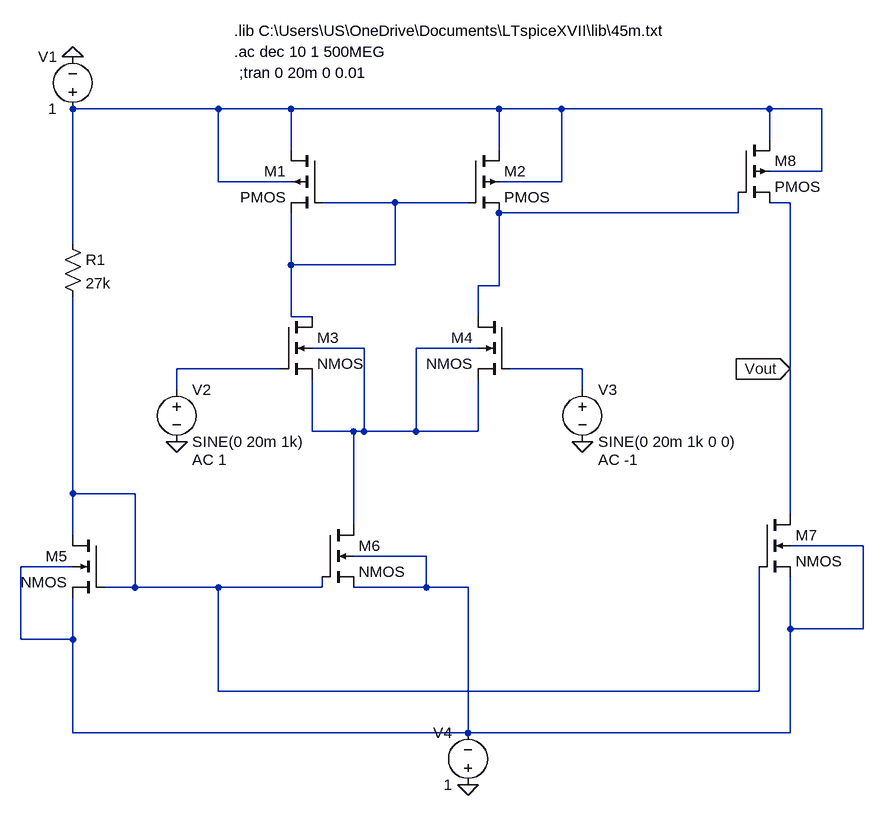
[diagram p0: schematic 19EC30047-OTA.asc]
19EC30047-OTA.asc, the LTspice schematic file:
Version 4
SHEET 1 1884 760
WIRE -192 -320 -416 -320
WIRE -80 -320 -192 -320
WIRE 240 -320 -80 -320
WIRE 336 -320 240 -320
WIRE 656 -320 336 -320
WIRE 736 -320 656 -320
WIRE 656 -272 656 -320
WIRE -80 -256 -80 -320
WIRE 240 -256 240 -320
WIRE 736 -224 736 -320
WIRE 736 -224 656 -224
WIRE -192 -208 -192 -320
WIRE -80 -208 -192 -208
WIRE 336 -208 336 -320
WIRE 336 -208 240 -208
WIRE 80 -176 -32 -176
WIRE 192 -176 80 -176
WIRE 688 -176 656 -176
WIRE 608 -160 608 -192
WIRE 608 -160 240 -160
WIRE -416 -112 -416 -320
WIRE -80 -80 -80 -160
WIRE 80 -80 80 -176
WIRE 80 -80 -80 -80
WIRE 240 -48 240 -160
WIRE 240 -48 208 -48
WIRE -80 0 -80 -80
WIRE -48 0 -80 0
WIRE 208 0 208 -48
WIRE 32 48 -48 48
WIRE 208 48 112 48
WIRE -96 80 -256 80
WIRE 368 80 256 80
WIRE 688 80 688 -176
WIRE -256 112 -256 80
WIRE 368 112 368 80
WIRE -48 176 -48 96
WIRE 16 176 -48 176
WIRE 32 176 32 48
WIRE 32 176 16 176
WIRE 112 176 112 48
WIRE 112 176 32 176
WIRE 208 176 208 96
WIRE 208 176 112 176
WIRE -416 272 -416 -32
WIRE -320 272 -416 272
WIRE 688 304 688 80
WIRE 16 320 16 176
WIRE -416 336 -416 272
WIRE 800 352 688 352
WIRE 128 368 16 368
WIRE -416 384 -496 384
WIRE -320 416 -320 272
WIRE -320 416 -368 416
WIRE -192 416 -320 416
WIRE -32 416 -32 400
WIRE -32 416 -192 416
WIRE 128 416 128 368
WIRE 128 416 16 416
WIRE 192 416 128 416
WIRE 688 480 688 400
WIRE 800 480 800 352
WIRE 800 480 688 480
WIRE -496 496 -496 384
WIRE -416 496 -416 432
WIRE -416 496 -496 496
WIRE -192 576 -192 416
WIRE 640 576 640 384
WIRE 640 576 -192 576
WIRE -416 640 -416 496
WIRE 192 640 192 416
WIRE 192 640 -416 640
WIRE 688 640 688 480
WIRE 688 640 192 640
FLAG -256 192 0
FLAG 368 192 0
FLAG 192 720 0
FLAG -416 -400 0
FLAG 688 80 Vout
IOPIN 688 80 In
SYMBOL voltage -256 96 R0
WINDOW 123 24 124 Left 2
WINDOW 39 0 0 Left 0
SYMATTR Value2 AC 1
SYMATTR InstName V2
SYMATTR Value SINE(0 20m 1k)
SYMBOL voltage 368 96 R0
WINDOW 123 24 124 Left 2
WINDOW 39 0 0 Left 0
SYMATTR Value2 AC -1
SYMATTR InstName V3
SYMATTR Value SINE(0 20m 1k 0 0)
SYMBOL voltage -416 -304 R180
WINDOW 0 24 96 Left 2
WINDOW 3 24 16 Left 2
WINDOW 123 0 0 Left 0
WINDOW 39 0 0 Left 0
SYMATTR InstName V1
SYMATTR Value 1
SYMBOL voltage 192 736 R180
WINDOW 0 24 96 Left 2
WINDOW 3 24 16 Left 2
WINDOW 123 0 0 Left 0
WINDOW 39 0 0 Left 0
SYMATTR InstName V4
SYMATTR Value 1
SYMBOL res -432 -128 R0
SYMATTR InstName R1
SYMATTR Value 27k
SYMBOL nmos4 -96 0 R0
SYMATTR InstName M3
SYMATTR Value2 l=500n w=3u
SYMBOL nmos4 256 0 M0
SYMATTR InstName M4
SYMATTR Value2 l=500n w=3u
SYMBOL nmos4 -32 320 R0
SYMATTR InstName M6
SYMATTR Value2 l=500n w=6u
SYMBOL nmos4 640 304 R0
SYMATTR InstName M7
SYMATTR Value2 l=500n w=38.5u
SYMBOL nmos4 -368 336 M0
SYMATTR InstName M5
SYMATTR Value2 l=500n w=6u
SYMBOL pmos4 608 -272 R0
SYMATTR InstName M8
SYMATTR Value2 l=500n w=90u
SYMBOL pmos4 -32 -256 M0
SYMATTR InstName M1
SYMATTR Value2 l=500n w=9u
SYMBOL pmos4 192 -256 R0
SYMATTR InstName M2
SYMATTR Value2 l=500n w=9u
TEXT -168 -440 Left 2 !.lib C:\\Users\\US\\OneDrive\\Documents\\LTspiceXVII\\lib\\45m.txt
TEXT -168 -408 Left 2 !.ac dec 10 1 500MEG
TEXT -160 -376 Left 2 !;tran 0 20m 0 0.01

The netlist it stands for:
* 19EC30047-OTA.asc
V2 N005 0 SINE(0 20m 1k) AC 1
V3 N006 0 SINE(0 20m 1k 0 0) AC -1
V1 N001 0 1
V4 0 N008 1
R1 N001 N007 27k
M3 N002 N005 N004 N004 NMOS l=500n w=3u
M4 N003 N006 N004 N004 NMOS l=500n w=3u
M6 N004 N007 N008 N008 NMOS l=500n w=6u
M7 Vout N007 N008 N008 NMOS l=500n w=38.5u
M5 N007 N007 N008 N008 NMOS l=500n w=6u
M8 N001 N003 Vout N001 PMOS l=500n w=90u
M1 N001 N002 N002 N001 PMOS l=500n w=9u
M2 N001 N002 N003 N001 PMOS l=500n w=9u
.model NMOS NMOS
.model PMOS PMOS
.lib standard.mos
.lib C:\Users\US\OneDrive\Documents\LTspiceXVII\lib\45m.txt
.ac dec 10 1 500MEG
;tran 0 20m 0 0.01
.backanno
.end